# EasyEDA schematic SCH_27C160-Replacement-Adapter_2025-10-29.json
TITLE: Sheet_1; REV: 1.0; Date: 2023-02-03; Sheet: 1/1; Drawn By: Chris Jamieson; Company: Your Company
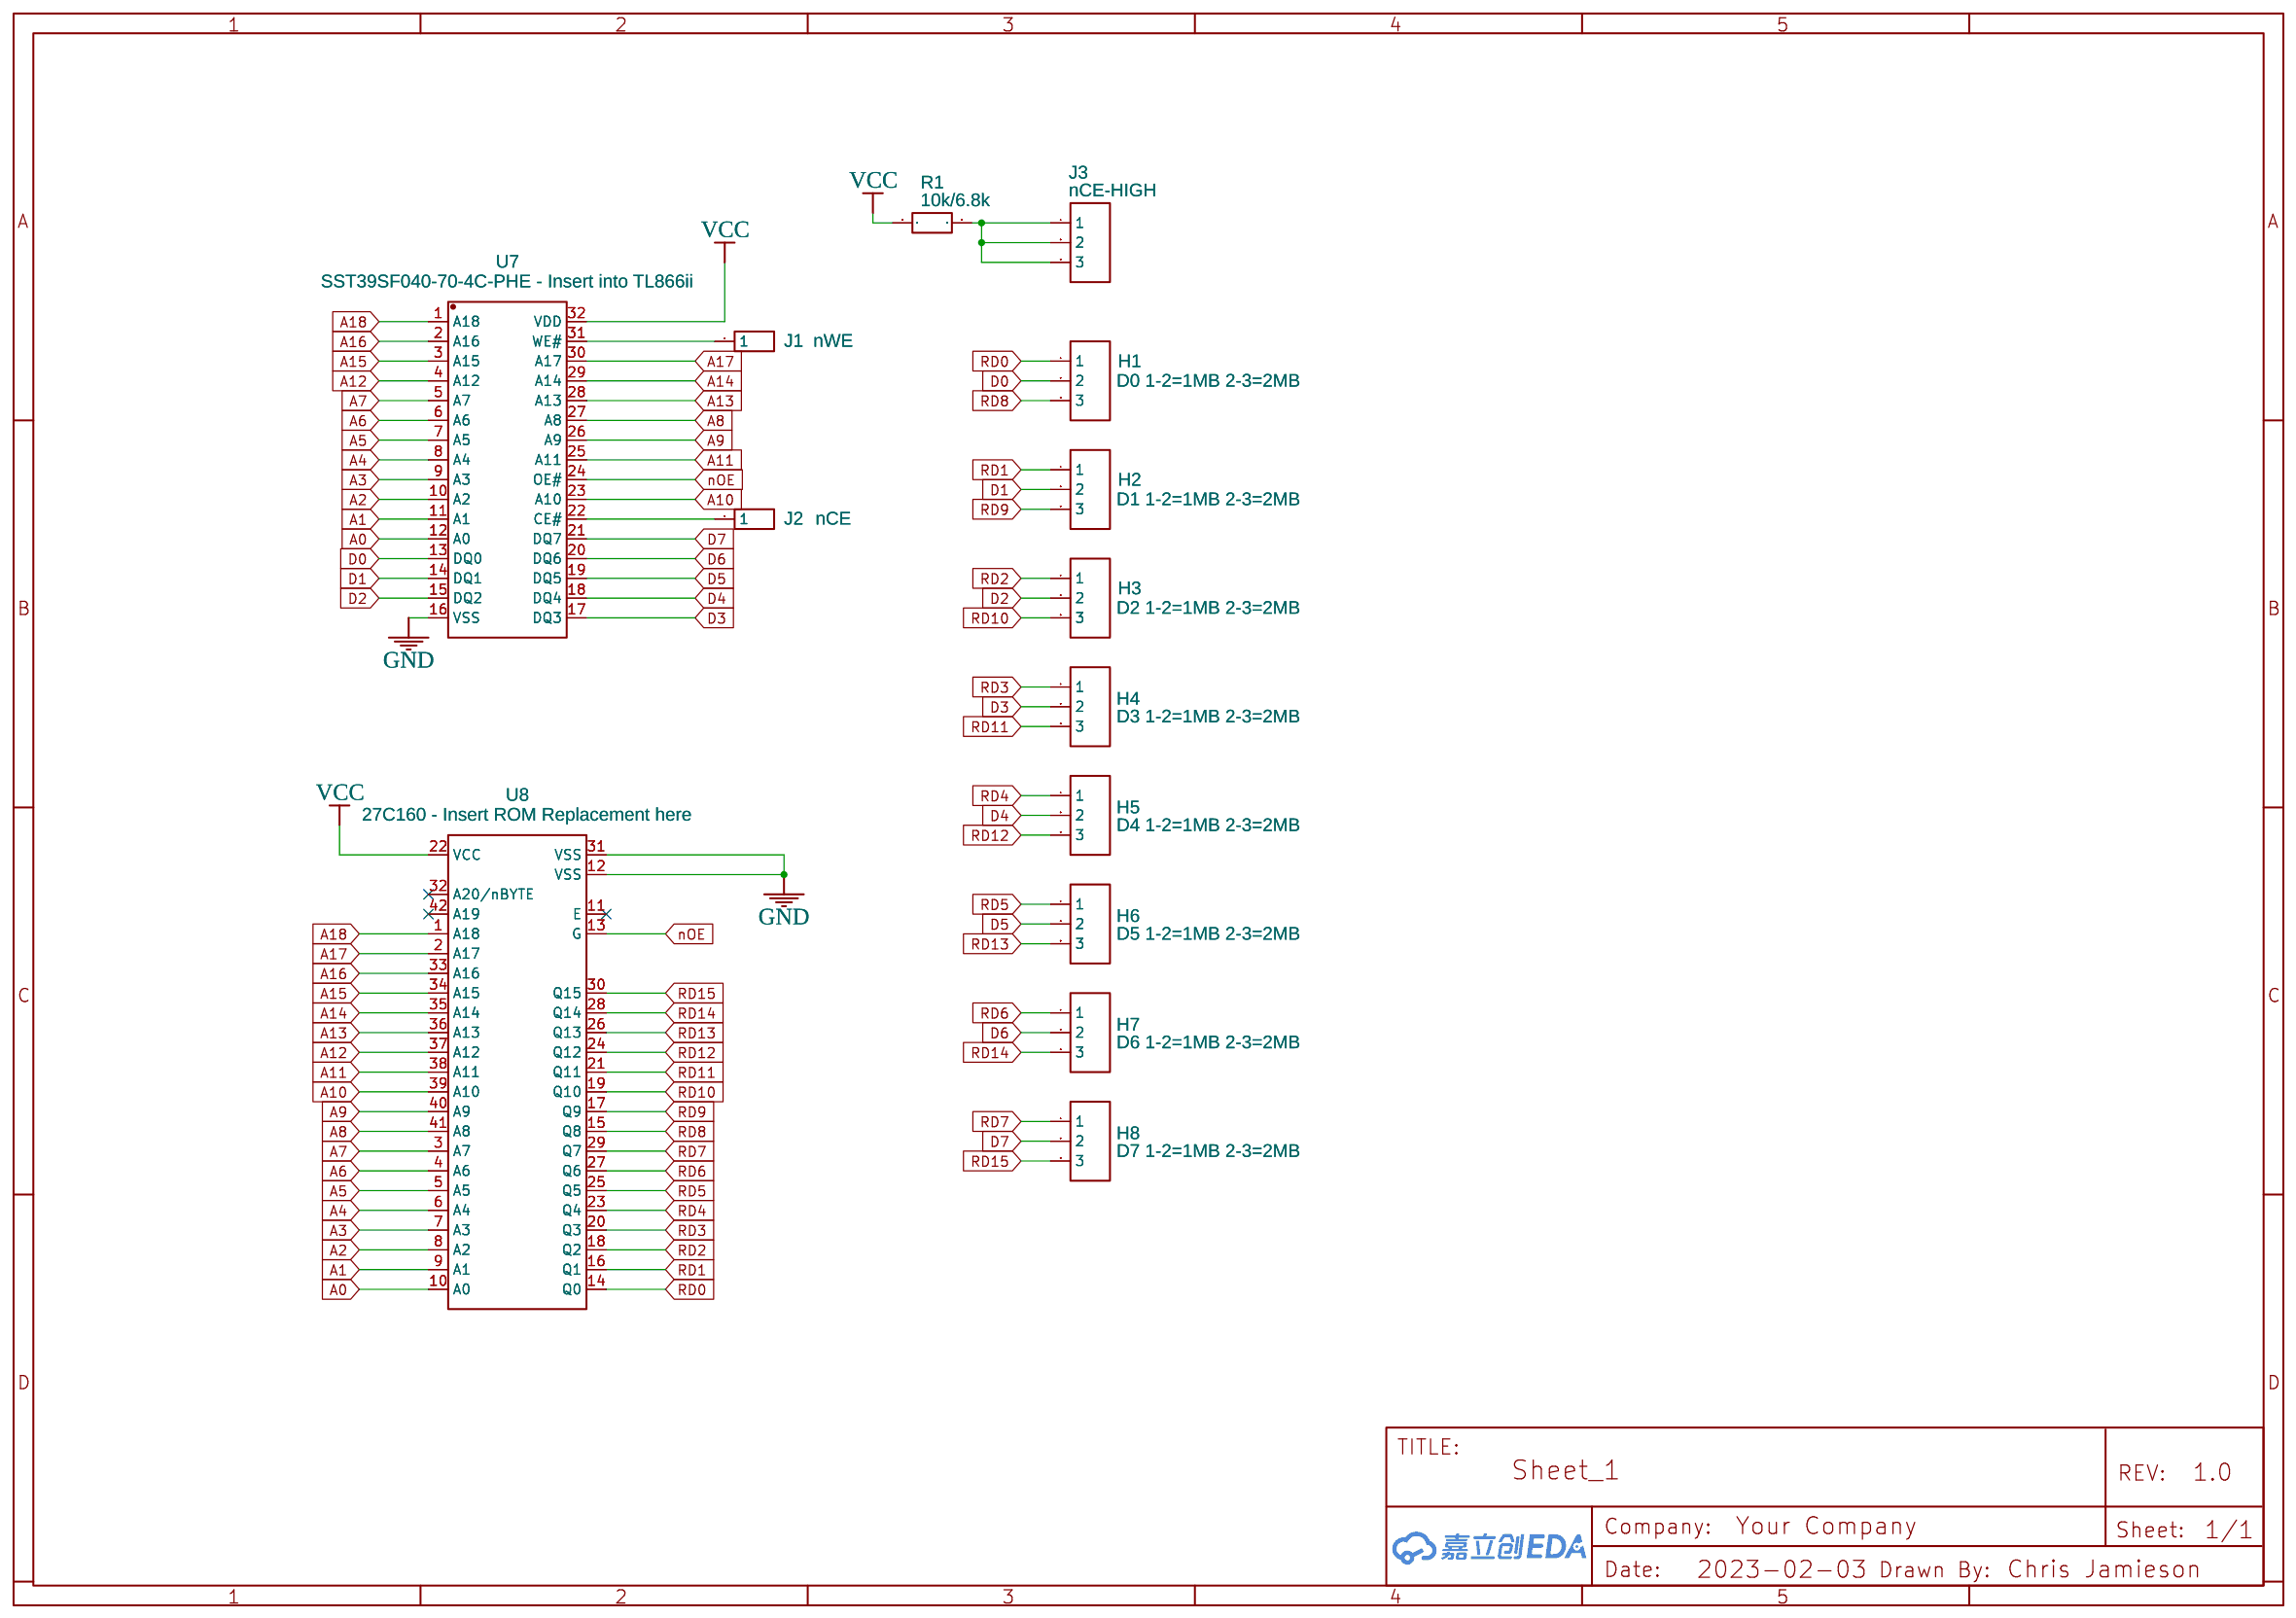
[diagram p0: schematic sheet]

## Parts
H1  D0 1-2=1MB 2-3=2MB  [HDR-F-2.54_1X3]
H2  D1 1-2=1MB 2-3=2MB  [HDR-F-2.54_1X3]
H3  D2 1-2=1MB 2-3=2MB  [HDR-F-2.54_1X3]
H4  D3 1-2=1MB 2-3=2MB  [HDR-F-2.54_1X3]
H5  D4 1-2=1MB 2-3=2MB  [HDR-F-2.54_1X3]
H6  D5 1-2=1MB 2-3=2MB  [HDR-F-2.54_1X3]
H7  D6 1-2=1MB 2-3=2MB  [HDR-F-2.54_1X3]
H8  D7 1-2=1MB 2-3=2MB  [HDR-F-2.54_1X3]
J1  nWE  [HDR-M-2.54_1X1]
J2  nCE  [HDR-M-2.54_1X1]
J3  nCE-HIGH  [HDR-M-2.54_1X3]
R1  10k/6.8k  [R_AXIAL-0.4]
U7  SST39SF040-70-4C-PHE - Insert into TL866ii  [PDIP-32_L42.0-W13.7-P2.54-LS15.2-BL]
U8  27C160 - Insert ROM Replacement here  [DIP42]

## Library data of the parts
H1-H8 = HDR-F-2.54_1x3: Supplier Part: C146690; Supplier: LCSC; Contributor: LCEDA_Lib
J1 J2 = HDR-M-2.54_1x1: Supplier Part: C81276; Supplier: LCSC; Contributor: LCEDA_Lib
J3 = HDR-M-2.54_1x3: Supplier Part: C180248; Supplier: LCSC; Contributor: LCEDA_Lib
R1 = R_AXIAL-0.4_EU: Contributor: LCEDA_Lib
U7 = SST39SF040-70-4C-PHE_C220176: Supplier: LCSC; Supplier Part: C220176; Manufacturer: MICROCHIP(美国微芯); Manufacturer Part: SST39SF040-70-4C-PHE; Contributor: LCSC; JLCPCB Part Class: Extended Part
U8 = M27C322: sourceId: 2fdXj3M8S

## Nets
GND: U7.16(VSS) U8.12(VSS) U8.31(VSS)
VCC: R1.1 U7.32(VDD) U8.22(VCC)
A0: U7.12(A0) U8.10(A0)
A1: U7.11(A1) U8.9(A1)
A2: U7.10(A2) U8.8(A2)
A3: U7.9(A3) U8.7(A3)
A4: U7.8(A4) U8.6(A4)
A5: U7.7(A5) U8.5(A5)
A6: U7.6(A6) U8.4(A6)
A7: U7.5(A7) U8.3(A7)
A8: U7.27(A8) U8.41(A8)
A9: U7.26(A9) U8.40(A9)
A10: U7.23(A10) U8.39(A10)
A11: U7.25(A11) U8.38(A11)
A12: U7.4(A12) U8.37(A12)
A13: U7.28(A13) U8.36(A13)
A14: U7.29(A14) U8.35(A14)
A15: U7.3(A15) U8.34(A15)
A16: U7.2(A16) U8.33(A16)
A17: U7.30(A17) U8.2(A17)
A18: U7.1(A18) U8.1(A18)
D0: H1.2 U7.13(DQ0)
D1: H2.2 U7.14(DQ1)
D2: H3.2 U7.15(DQ2)
D3: H4.2 U7.17(DQ3)
D4: H5.2 U7.18(DQ4)
D5: H6.2 U7.19(DQ5)
D6: H7.2 U7.20(DQ6)
D7: H8.2 U7.21(DQ7)
nOE: U7.24(OE#) U8.13(G)
RD0: H1.1 U8.14(Q0)
RD1: H2.1 U8.16(Q1)
RD2: H3.1 U8.18(Q2)
RD3: H4.1 U8.20(Q3)
RD4: H5.1 U8.23(Q4)
RD5: H6.1 U8.25(Q5)
RD6: H7.1 U8.27(Q6)
RD7: H8.1 U8.29(Q7)
RD8: H1.3 U8.15(Q8)
RD9: H2.3 U8.17(Q9)
RD10: H3.3 U8.19(Q10)
RD11: H4.3 U8.21(Q11)
RD12: H5.3 U8.24(Q12)
RD13: H6.3 U8.26(Q13)
RD14: H7.3 U8.28(Q14)
RD15: H8.3 U8.30(Q15)
Net-(J1-1): J1.1 U7.31(WE#)
Net-(J2-1): J2.1 U7.22(CE#)
Net-(J3-1): J3.1 J3.2 J3.3 R1.2

Not connected (* = marked no-connect by the designer): U8 11(E)* 32(A20/nBYTE)* 42(A19)*
